# Altium schematic sheet AOBoard.SchDoc: AO Board
size A4; Revision: 1.0
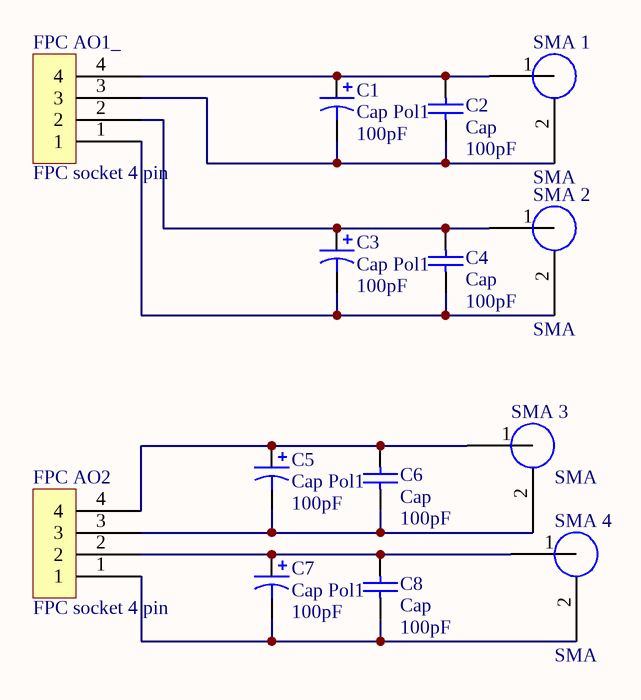
[diagram p0: AOBoard.SchDoc]

## Parts
C1  Cap Pol1  value 100pF  [RB7.6-15]
C2  Cap  value 100pF  [RAD-0.3]
C3  Cap Pol1  value 100pF  [RB7.6-15]
C4  Cap  value 100pF  [RAD-0.3]
C5  Cap Pol1  value 100pF  [RB7.6-15]
C6  Cap  value 100pF  [RAD-0.3]
C7  Cap Pol1  value 100pF  [RB7.6-15]
C8  Cap  value 100pF  [RAD-0.3]
FPC_AO1_  FPC socket 4 pin  [FPC 4Pin]
FPC_AO2  FPC socket 4 pin  [FPC 4Pin]
SMA_1  SMA  [SMA]
SMA_2  SMA  [SMA]
SMA_3  SMA  [SMA]
SMA_4  SMA  [SMA]

## Nets
NetC1_1: C1.1 C2.2 FPC_AO1_.4 SMA_1.1(Core)
NetC1_2: C1.2 C2.1 FPC_AO1_.3 SMA_1.2(Ground)
NetC3_1: C3.1 C4.2 FPC_AO1_.2 SMA_2.1(Core)
NetC3_2: C3.2 C4.1 FPC_AO1_.1 SMA_2.2(Ground)
NetC5_1: C5.1 C6.2 FPC_AO2.4 SMA_3.1(Core)
NetC5_2: C5.2 C6.1 FPC_AO2.3 SMA_3.2(Ground)
NetC7_1: C7.1 C8.2 FPC_AO2.2 SMA_4.1(Core)
NetC7_2: C7.2 C8.1 FPC_AO2.1 SMA_4.2(Ground)

## Notes on the sheet
- Title
- Size:
- Date:
- A4
- Number:
- Time:
- Revision:
- Sheet
- of
- File:

## Library data of the parts
C1 C3 C5 C7 = Cap Pol1: Polarized Capacitor (Radial); Published: 8-Jun-2000; LatestRevisionDate: 17-Jul-2002; LatestRevisionNote: Re-released for DXP Platform.; PackageReference: RB7.6-15; Publisher: Altium Limited; PackageDescription: Polarized Capacitor (Radial); 2 Leads
C2 C4 C6 C8 = Cap: Capacitor; Published: 8-Jun-2000; LatestRevisionDate: 17-Jul-2002; LatestRevisionNote: Re-released for DXP Platform.; PackageReference: RAD-0.3; Publisher: Altium Limited; PackageDescription: Radial Cap, Thru-Hole; 2 Leads; 0.3 in Pin Spacing